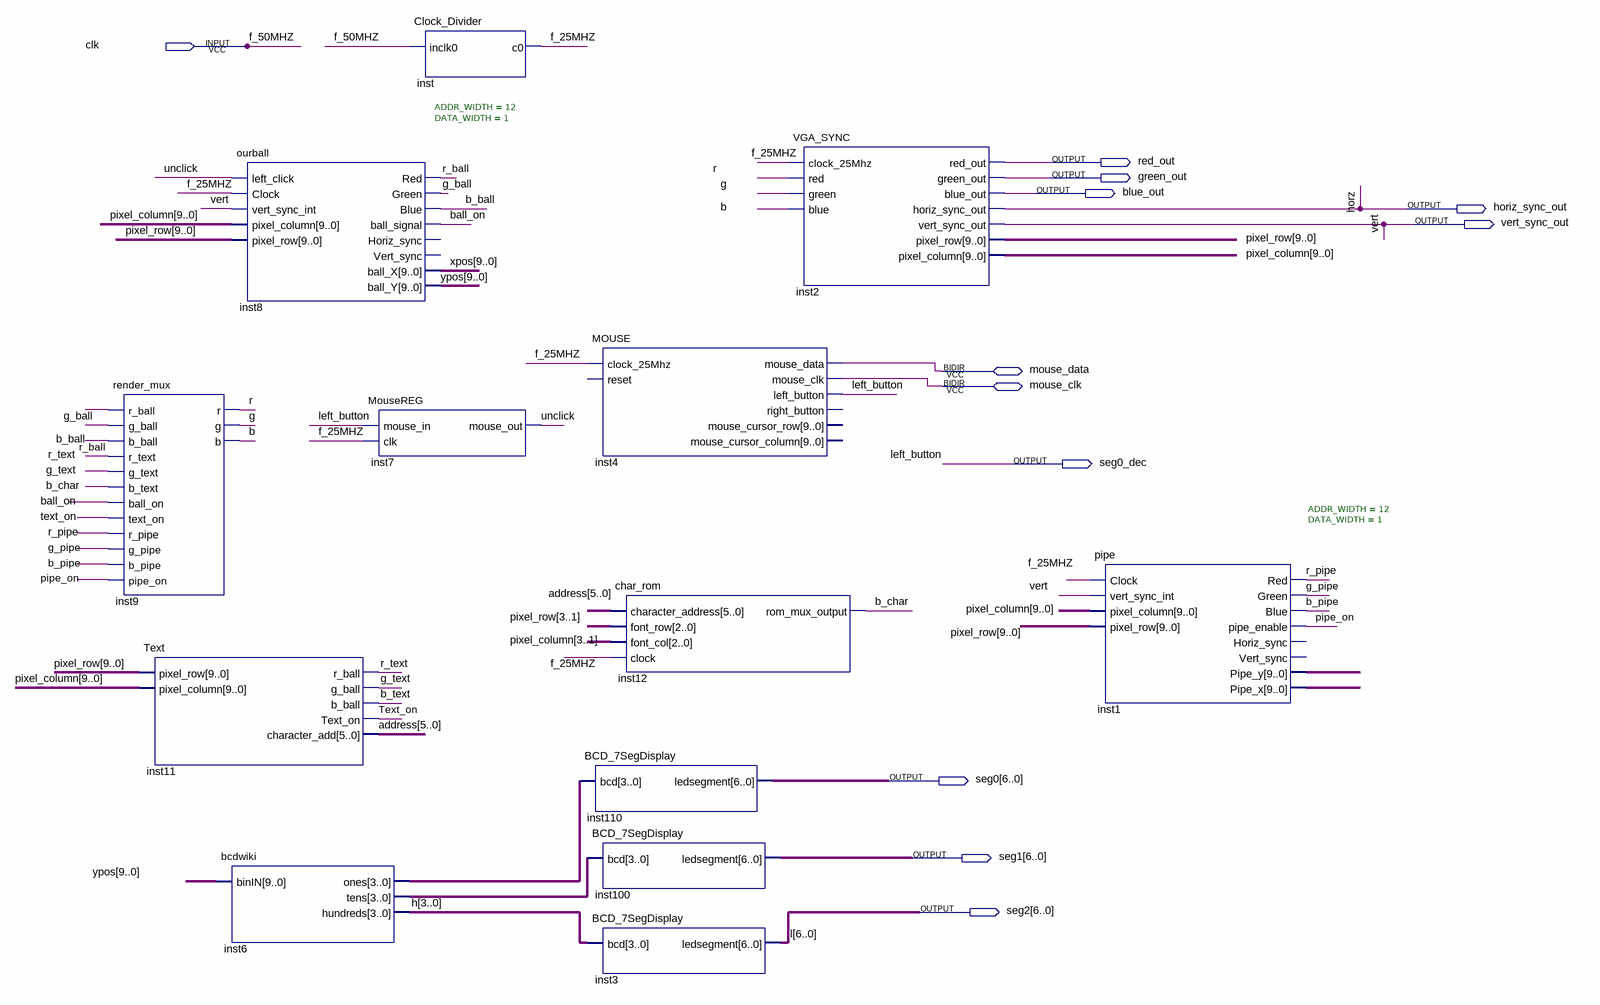
[diagram p0: schematic sheet]
// Quartus schematic Colour.bdf as structural Verilog: 13 symbols, 12 pins
module Colour (
  input  clk,
  inout  mouse_data,
  inout  mouse_clk,
  output red_out,
  output green_out,
  output blue_out,
  output horiz_sync_out,
  output vert_sync_out,
  output seg0_dec,
  output [6:0] seg0,
  output [6:0] seg1,
  output [6:0] seg2
);

  wire b, b_ball, b_char, b_pipe, b_text, ball_on, f_25MHZ, g, g_ball, g_pipe, g_text, pipe_on, r, r_ball,
       r_pipe, r_text, Text_on, unclick;
  wire [3:0] h, inst6_ones, inst6_tens;
  wire [5:0] address;
  wire [9:0] inst1_pipe_x, inst1_pipe_y, pixel_column, pixel_row, xpos, ypos;

  render_mux inst9 (
    .r_ball(r_ball), .g_ball(g_ball), .b_ball(b_ball), .r_text(r_text), .g_text(g_text), .b_text(b_char),
    .ball_on(ball_on), .text_on(Text_on), .r_pipe(r_pipe), .g_pipe(g_pipe), .b_pipe(b_pipe),
    .pipe_on(pipe_on), .r(r), .g(g), .b(b));
  Text inst11 (
    .pixel_row(pixel_row), .pixel_column(pixel_column), .r_ball(r_text), .g_ball(g_text), .b_ball(b_text),
    .Text_on(Text_on), .character_add(address));
  ourball #(.ADDR_WIDTH(12), .DATA_WIDTH(1)) inst8 (
    .left_click(unclick), .Clock(f_25MHZ), .vert_sync_int(vert_sync_out), .pixel_column(pixel_column),
    .pixel_row(pixel_row), .Red(r_ball), .Green(g_ball), .Blue(b_ball), .ball_signal(ball_on), .ball_X(xpos),
    .ball_Y(ypos));  // open: Horiz_sync, Vert_sync
  bcdwiki inst6 (.binIN(ypos), .ones(inst6_ones), .tens(inst6_tens), .hundreds(h));
  MouseREG inst7 (.mouse_in(seg0_dec), .clk(f_25MHZ), .mouse_out(unclick));
  Clock_Divider inst (.inclk0(clk), .c0(f_25MHZ));
  MOUSE inst4 (
    .clock_25Mhz(f_25MHZ), .left_button(seg0_dec), .mouse_data(mouse_data), .mouse_clk(mouse_clk));  // open: reset, right_button, mouse_cursor_row, mouse_cursor_column
  char_rom inst12 (
    .character_address(address), .font_row(pixel_row[3:1]), .font_col(pixel_column[3:1]), .clock(f_25MHZ),
    .rom_mux_output(b_char));
  BCD_7SegDisplay inst110 (.bcd(inst6_ones), .ledsegment(seg0));
  BCD_7SegDisplay inst100 (.bcd(inst6_tens), .ledsegment(seg1));
  BCD_7SegDisplay inst3 (.bcd(h), .ledsegment(seg2));
  VGA_SYNC inst2 (
    .clock_25Mhz(f_25MHZ), .red(r), .green(g), .blue(b), .red_out(red_out), .green_out(green_out),
    .blue_out(blue_out), .horiz_sync_out(horiz_sync_out), .vert_sync_out(vert_sync_out),
    .pixel_row(pixel_row), .pixel_column(pixel_column));
  pipe #(.ADDR_WIDTH(12), .DATA_WIDTH(1)) inst1 (
    .Clock(f_25MHZ), .vert_sync_int(vert_sync_out), .pixel_column(pixel_column), .pixel_row(pixel_row),
    .Red(r_pipe), .Green(g_pipe), .Blue(b_pipe), .pipe_enable(pipe_on), .Pipe_y(inst1_pipe_y),
    .Pipe_x(inst1_pipe_x));  // open: Horiz_sync, Vert_sync

  // Other names for the same wires on the sheet: f_50MHZ = clk; horz = horiz_sync_out; left_button = seg0_dec;
  //   l[6:0] = seg2; vert = vert_sync_out
endmodule
